# Altium project Telemetry_Pi_Board.PrjPcb
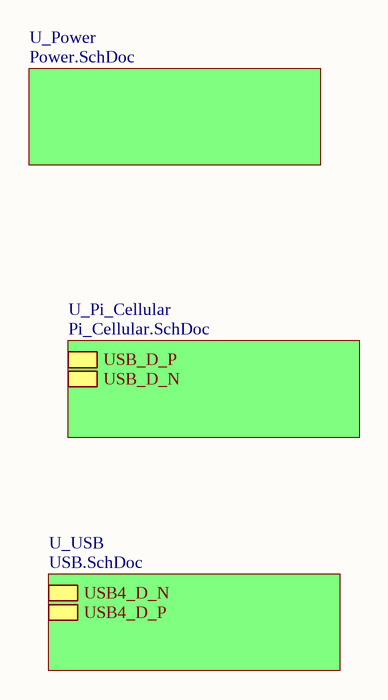
[diagram p0: Telemetry_Pi_Board.SchDoc]
6 sheets, 37 parts. Net scope: hierarchical (ports join the sheet entries above them; power ports are global).
Board file: PCB2.PcbDoc
Sheets:
  Telemetry_Pi_Board.SchDoc
    U_Power = Power.SchDoc
    U_Pi_Cellular = Pi_Cellular.SchDoc
    U_USB = USB.SchDoc
  Pi_Power.SchDoc
  Ethernet.SchDoc

## Sheet Telemetry_Pi_Board.SchDoc
size 279 x 215 mm; SheetNumber: 1; SheetTotal: 6

### Sub-sheets
U_Pi_Cellular = Pi_Cellular.SchDoc: USB_D_P, USB_D_N
U_Power = Power.SchDoc: no entries
U_USB = USB.SchDoc: USB4_D_N, USB4_D_P

## Sheet Power.SchDoc
size 279 x 215 mm; SheetNumber: 2; SheetTotal: 3
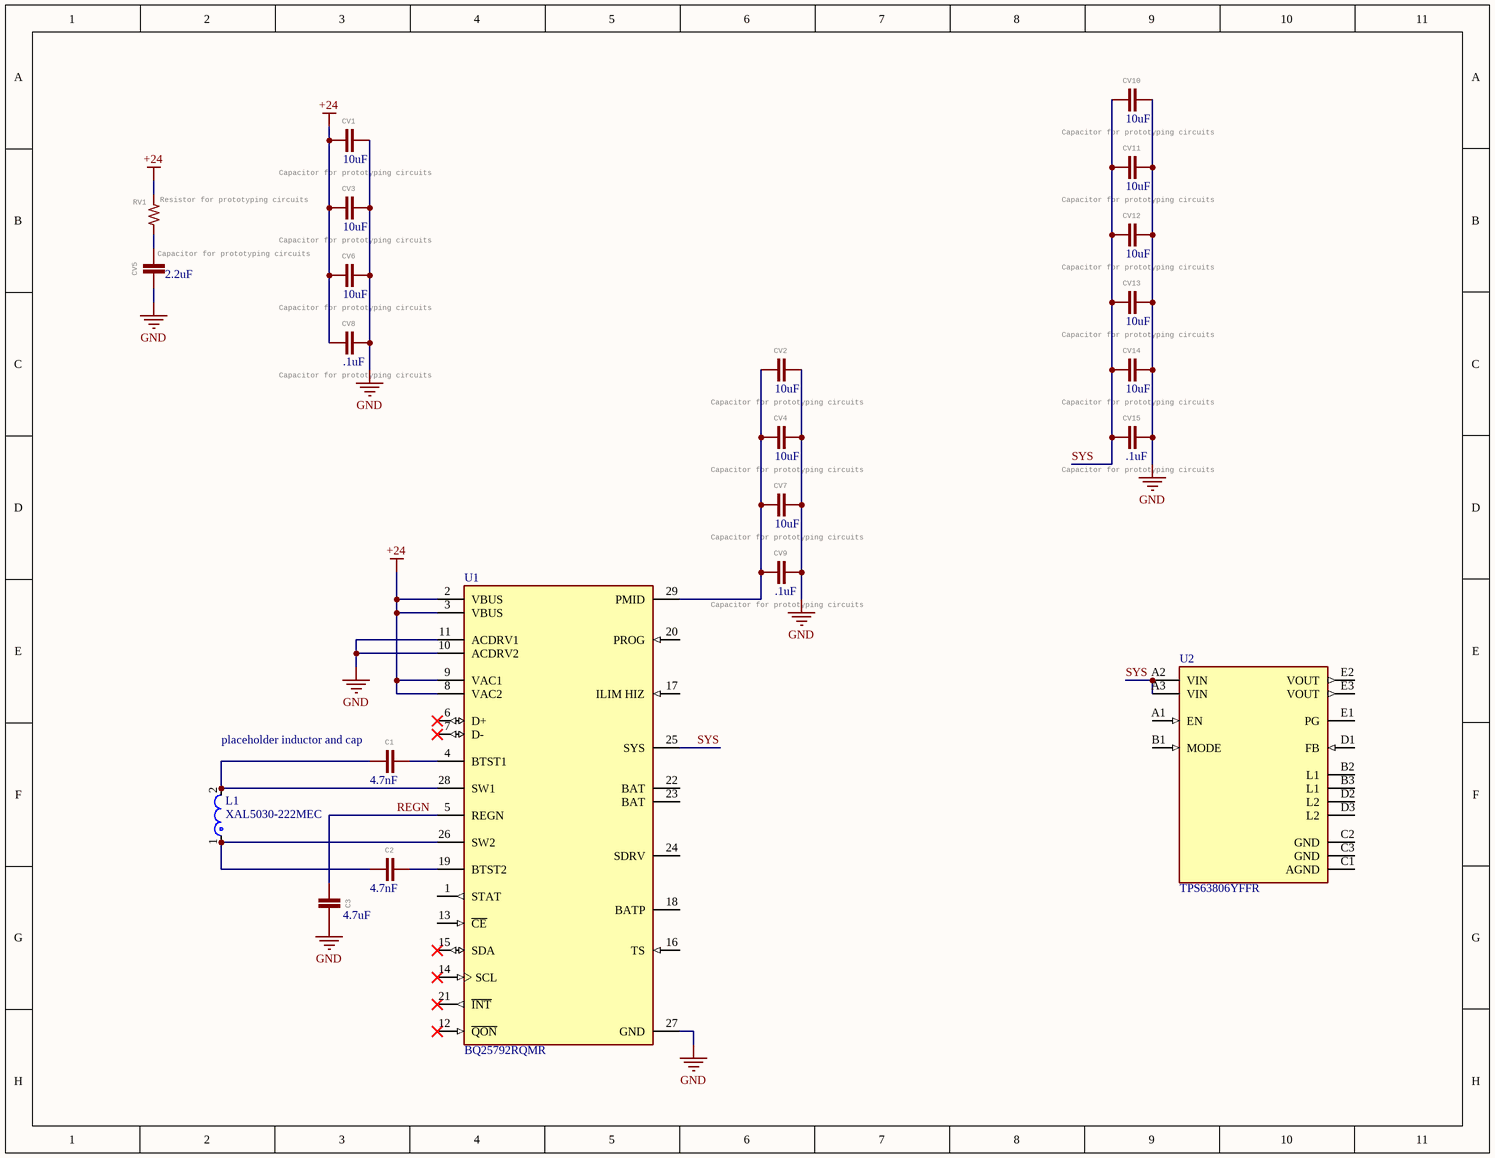
[diagram p1: Power.SchDoc]

### Parts
C1  CAPACITANCE: 4.7nF  [0805-CAP]  (hidden comment: Capacitor, Non-Polarized  VJ...1BC Series Datasheet  Samsung Datasheet  Walsin Datasheet  GRM188R61A226ME15D  GRM188R61E106MA73D  885012006013  2220Y6300105KXTWS2  Yageo Class 2, X5R  TDK C Series  AVX Automotive MLCC   KEMET X7R Series  Kyocera AVX  GRM21BR61H  C1812W104KDRACTU)
C2  CAPACITANCE: 4.7nF  [0805-CAP]  (hidden comment: Capacitor, Non-Polarized  VJ...1BC Series Datasheet  Samsung Datasheet  Walsin Datasheet  GRM188R61A226ME15D  GRM188R61E106MA73D  885012006013  2220Y6300105KXTWS2  Yageo Class 2, X5R  TDK C Series  AVX Automotive MLCC   KEMET X7R Series  Kyocera AVX  GRM21BR61H  C1812W104KDRACTU)
C3  CAPACITANCE: 4.7uF  [0805-CAP]  (hidden comment: Capacitor, Non-Polarized  VJ...1BC Series Datasheet  Samsung Datasheet  Walsin Datasheet  GRM188R61A226ME15D  GRM188R61E106MA73D  885012006013  2220Y6300105KXTWS2  Yageo Class 2, X5R  TDK C Series  AVX Automotive MLCC   KEMET X7R Series  Kyocera AVX  GRM21BR61H  C1812W104KDRACTU)
CV1  Capacitor for prototyping circuits  CAPACITANCE: 10uF  [0603-CAP]
CV2  Capacitor for prototyping circuits  CAPACITANCE: 10uF  [0603-CAP]
CV3  Capacitor for prototyping circuits  CAPACITANCE: 10uF  [0603-CAP]
CV4  Capacitor for prototyping circuits  CAPACITANCE: 10uF  [0603-CAP]
CV5  Capacitor for prototyping circuits  CAPACITANCE: 2.2uF  [0603-CAP]
CV6  Capacitor for prototyping circuits  CAPACITANCE: 10uF  [0603-CAP]
CV7  Capacitor for prototyping circuits  CAPACITANCE: 10uF  [0603-CAP]
CV8  Capacitor for prototyping circuits  CAPACITANCE: .1uF  [0603-CAP]
CV9  Capacitor for prototyping circuits  CAPACITANCE: .1uF  [0603-CAP]
CV10  Capacitor for prototyping circuits  CAPACITANCE: 10uF  [0603-CAP]
CV11  Capacitor for prototyping circuits  CAPACITANCE: 10uF  [0603-CAP]
CV12  Capacitor for prototyping circuits  CAPACITANCE: 10uF  [0603-CAP]
CV13  Capacitor for prototyping circuits  CAPACITANCE: 10uF  [0603-CAP]
CV14  Capacitor for prototyping circuits  CAPACITANCE: 10uF  [0603-CAP]
CV15  Capacitor for prototyping circuits  CAPACITANCE: .1uF  [0603-CAP]
L1  XAL5030-222MEC  [FP-XAL5030-222MEC-MFG]
RV1  Resistor for prototyping circuits  [0603-RES]
U1  BQ25792RQMR  [FP-RQM0029A-MFG]
U2  TPS63806YFFR  [FP-YFF0015-IPC_C]

### Nets
+24: CV1.2 CV3.2 CV6.2 CV8.2 RV1.2 U1.2(VBUS) U1.3(VBUS) U1.8(VAC2) U1.9(VAC1)
GND: C3.1 CV1.1 CV2.1 CV3.1 CV4.1 CV5.2 CV6.1 CV7.1 CV8.1 CV9.1 CV10.1 CV11.1 CV12.1 CV13.1 CV14.1 CV15.1 U1.10(ACDRV2) U1.11(ACDRV1) U1.27(GND)
REGN: C3.2 U1.5(REGN)
SYS: CV10.2 CV11.2 CV12.2 CV13.2 CV14.2 CV15.2 U1.25(SYS) U2.A2(VIN) U2.A3(VIN)
NetC1_1: C1.1 U1.4(BTST1)
NetC1_2: C1.2 L1.2 U1.28(SW1)
NetC2_1: C2.1 U1.19(BTST2)
NetC2_2: C2.2 L1.1 U1.26(SW2)
NetCV2_2: CV2.2 CV4.2 CV7.2 CV9.2 U1.29(PMID)
NetCV5_1: CV5.1 RV1.1

Not connected (* = marked no-connect by the designer): U1 1(STAT) 6(D+)* 7(D-)* 12(~{QON})* 13(~{CE}) 14(SCL)* 15(SDA)* 16(TS) 17(ILIM_HIZ) 18(BATP) 20(PROG) 21(~{INT})* 22(BAT) 23(BAT) 24(SDRV); U2 A1(EN) B1(MODE) B2(L1) B3(L1) C1(AGND) C2(GND) C3(GND) D1(FB) D2(L2) D3(L2) E1(PG) E2(VOUT) E3(VOUT)

### Notes on the sheet
- (near C1) placeholder inductor and cap

### Library data of the parts
C1-C3 = CAPACITOR_?_*0805: MPN: C0805C224K1RACTU; MPN: CC0805MKX5R8BB226; MANUFACTURER: Murata; MPN: GRM21BR61H106KE43L; GateName_1: G$1; DeviceName: 0805; CAPACITANCE: 0.22µF; DKPN: 399-8049-1-ND; MOPN: 80-C0805C224K1R; TOLERANCE: 10%; VOLTAGE: 100V; DKPN: 311-1903-1-ND; MOPN: 603-CC805MKX5R8BB226; TOLERANCE: 20%; VOLTAGE: 25V; CAPACITANCE: 10uF; DKPN: 490-18663-2-ND; MOPN: 81-GRM21BR61H106KE3L; VOLTAGE: 50V; SymbolName_1: CAPACITOR; LibraryName: HyTechDevices; DeviceSetName: CAPACITOR_?_*; Package: 0805-CAP; MANUFACTURER: KEMET; MANUFACTURER: Yageo
CV1-CV15 = CAPACITOR_VALUE: GateName_1: G$1; SymbolName_1: CAPACITOR_VALUE; LibraryName: HyTechDevices; DeviceSetName: CAPACITOR_VALUE; Package: 0603-CAP
L1 = CMP-11268-000158-1: Fixed Inductors 2.2uH Shld 20% 9.2A 14.5mOhms AECQ2 SRF: 38MHz Test Freq: 1MHz; Test Frequency: 100kHz; Core Material: Composite; Shielding: Shielded; DC Resistance (DCR): 14.5mR; RMS Current (Irms): 9.7A; Max Operating Temperature: 125°C; Self Resonant Frequency: 38MHz; Package Quantity: 400; Min Operating Temperature: -40°C; Width: 5.48mm; Series: XAL5030; Inductance: 2.2uH; Length: 5.68mm; RoHS Compliant: Yes; Termination: SMD/SMT; Packaging: Tape and Reel; Max DC Current: 9.2A; Saturation Current: 9.2A; Lead Free: Contains Lead; Mount: Surface Mount; Case/Package: SMD/SMT; Height: 3.1mm; Inductance Tolerance: 20%; Tolerance: 20%
RV1 = RESISTOR_VALUE: GateName_1: G$1; SymbolName_1: RESISTOR_VALUE; LibraryName: HyTechDevices; DeviceSetName: RESISTOR_VALUE; Package: 0603-RES
U1 = BQ25792RQMR: Power Supply Management Circuit, Adjustable, 1 Channel, 3.4, PQCC29; Manufacturer: Texas Instruments; RoHS Compliant: Yes; Supplier: Mouser; Supplier Part Number: 595-BQ25792RQMR; RoHS: Yes; Category: Battery Management; Stock: 1625; Pricing: 1=6.18, 10=5.59, 25=5.33, 50=5.33, 100=4.62, 250=4.42, 500=4.03, 1000=3.51, 3000=3.32, 6000=3.31, 10000=3.32 (USD); Manufacturer Part Number: BQ25792RQMR
U2 = TPS63806YFFR: Switching Regulator, Current-mode, 2.5A, 3100kHz Switching Freq-Max, PBGA15; Manufacturer: Texas Instruments; Supplier: Mouser; Supplier Part Number: 595-TPS63806YFFR; Manufacturer Part Number: TPS63806YFFR; RoHS: Yes; Category: Voltage Regulators - Switching; Stock: 11286; Pricing: 1=2.47, 10=2.22, 25=2.1, 50=2.1, 100=1.8, 250=1.7, 500=1.5, 1000=1.33, 3000=1.25, 6000=1.22, 10000=1.22 (USD); ComponentLink1URL: https://www.ti.com:443/lit/ds/symlink/tps63805.pdf?src-supplier=IHS+Markit; ComponentLink1Description: https://www.ti.com:443/lit/ds/symlink/tps63805.pdf?src-supplier=IHS+Markit

## Sheet Pi_Cellular.SchDoc
size A; SheetNumber: 3; SheetTotal: 6
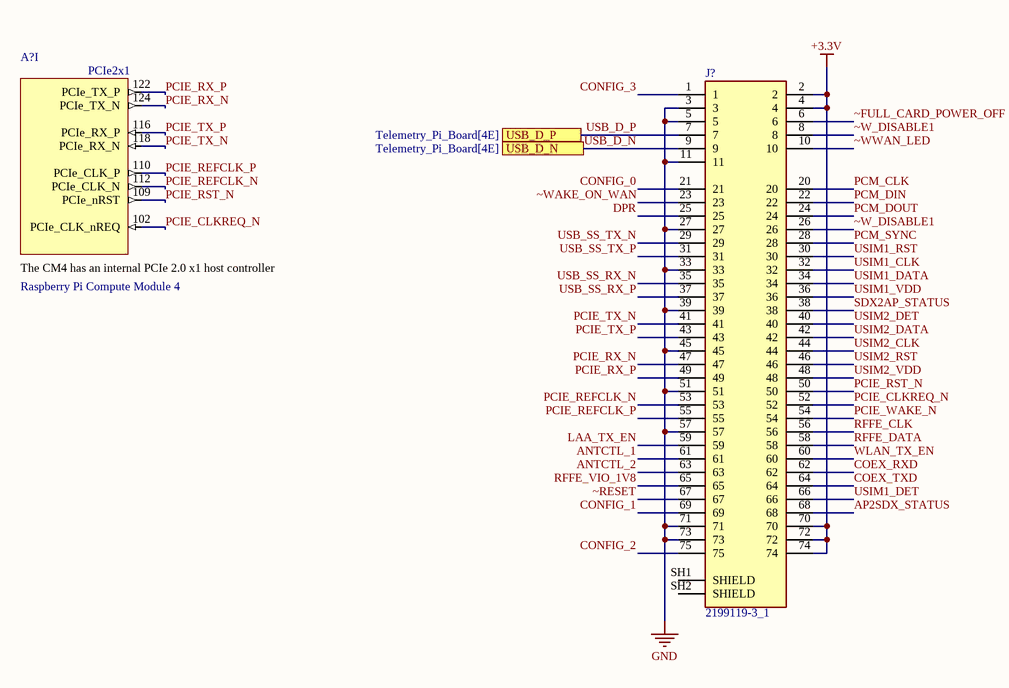
[diagram p2: Pi_Cellular.SchDoc]

### Parts
(Parts that share a designator on the sheet are numbered #1, #2 ... from top to bottom, then left to right.)
A?#1  Raspberry Pi Compute Module 4  [CM4-F40C-100DS-0.4v_1.5mm_0mm]  (part I of 21)  (no BOM)
J?  2199119-3_1  [TE_2199119-3]

### Ports
USB_D_N (see Telemetry_Pi_Board[4E]), USB_D_P (see Telemetry_Pi_Board[4E])

### Nets
+3.3V: J?.2 J?.4 J?.70 J?.72 J?.74
GND: J?.3 J?.5 J?.11 J?.27 J?.33 J?.39 J?.45 J?.51 J?.57 J?.71 J?.73
ANTCTL_1: J?.61
ANTCTL_2: J?.63
AP2SDX_STATUS: J?.68
COEX_RXD: J?.62
COEX_TXD: J?.64
CONFIG_0: J?.21
CONFIG_1: J?.69
CONFIG_2: J?.75
CONFIG_3: J?.1
DPR: J?.25
LAA_TX_EN: J?.59
PCIE_CLKREQ_N: A?#1.102(PCIe_CLK_nREQ) J?.52
PCIE_REFCLK_N: A?#1.112(PCIe_CLK_N) J?.53
PCIE_REFCLK_P: A?#1.110(PCIe_CLK_P) J?.55
PCIE_RST_N: A?#1.109(PCIe_nRST) J?.50
PCIE_RX_N: A?#1.124(PCIe_TX_N) J?.47
PCIE_RX_P: A?#1.122(PCIe_TX_P) J?.49
PCIE_TX_N: A?#1.118(PCIe_RX_N) J?.41
PCIE_TX_P: A?#1.116(PCIe_RX_P) J?.43
PCIE_WAKE_N: J?.54
PCM_CLK: J?.20
PCM_DIN: J?.22
PCM_DOUT: J?.24
PCM_SYNC: J?.28
RFFE_CLK: J?.56
RFFE_DATA: J?.58
RFFE_VIO_1V8: J?.65
SDX2AP_STATUS: J?.38
USB_D_N: J?.9 ; port USB_D_N
USB_D_P: J?.7 ; port USB_D_P
USB_SS_RX_N: J?.35
USB_SS_RX_P: J?.37
USB_SS_TX_N: J?.29
USB_SS_TX_P: J?.31
USIM1_CLK: J?.32
USIM1_DATA: J?.34
USIM1_DET: J?.66
USIM1_RST: J?.30
USIM1_VDD: J?.36
USIM2_CLK: J?.44
USIM2_DATA: J?.42
USIM2_DET: J?.40
USIM2_RST: J?.46
USIM2_VDD: J?.48
WLAN_TX_EN: J?.60
~FULL_CARD_POWER_OFF: J?.6
~RESET: J?.67
~W_DISABLE1: J?.8 J?.26
~WAKE_ON_WAN: J?.23
~WWAN_LED: J?.10

Not connected (* = marked no-connect by the designer): J? SH1(SHIELD) SH2(SHIELD)

### Notes on the sheet
- (in symbol CM4, part I) PCIe2x1; The CM4 has an internal PCIe 2.0 x1 host controller

### Library data of the parts
A?#1 = CM4: Raspberry Pi Compute Module 4 by Amornthep Phunsin
J? = 2199119-3_1: Connector, Backplane, Housing, Receptacle, 67 Position, 2row; MF: TE Connectivity; Check_prices: https://www.snapeda.com/parts/2199119-3/TE+Connectivity+AMP+Connectors/view-part/?ref=eda; Value: *; MP: 2199119-3; Purchase-URL: https://pricing.snapeda.com/search/part/2199119-3/?ref=eda; SnapEDA_Link: https://www.snapeda.com/parts/2199119-3/TE+Connectivity+AMP+Connectors/view-part/?ref=snap; Package: None; Digi-Key_Part_Number: A115899TR-ND; EU_RoHS_Compliance: Compliant

## Sheet USB.SchDoc
size A; SheetNumber: 4; SheetTotal: 6
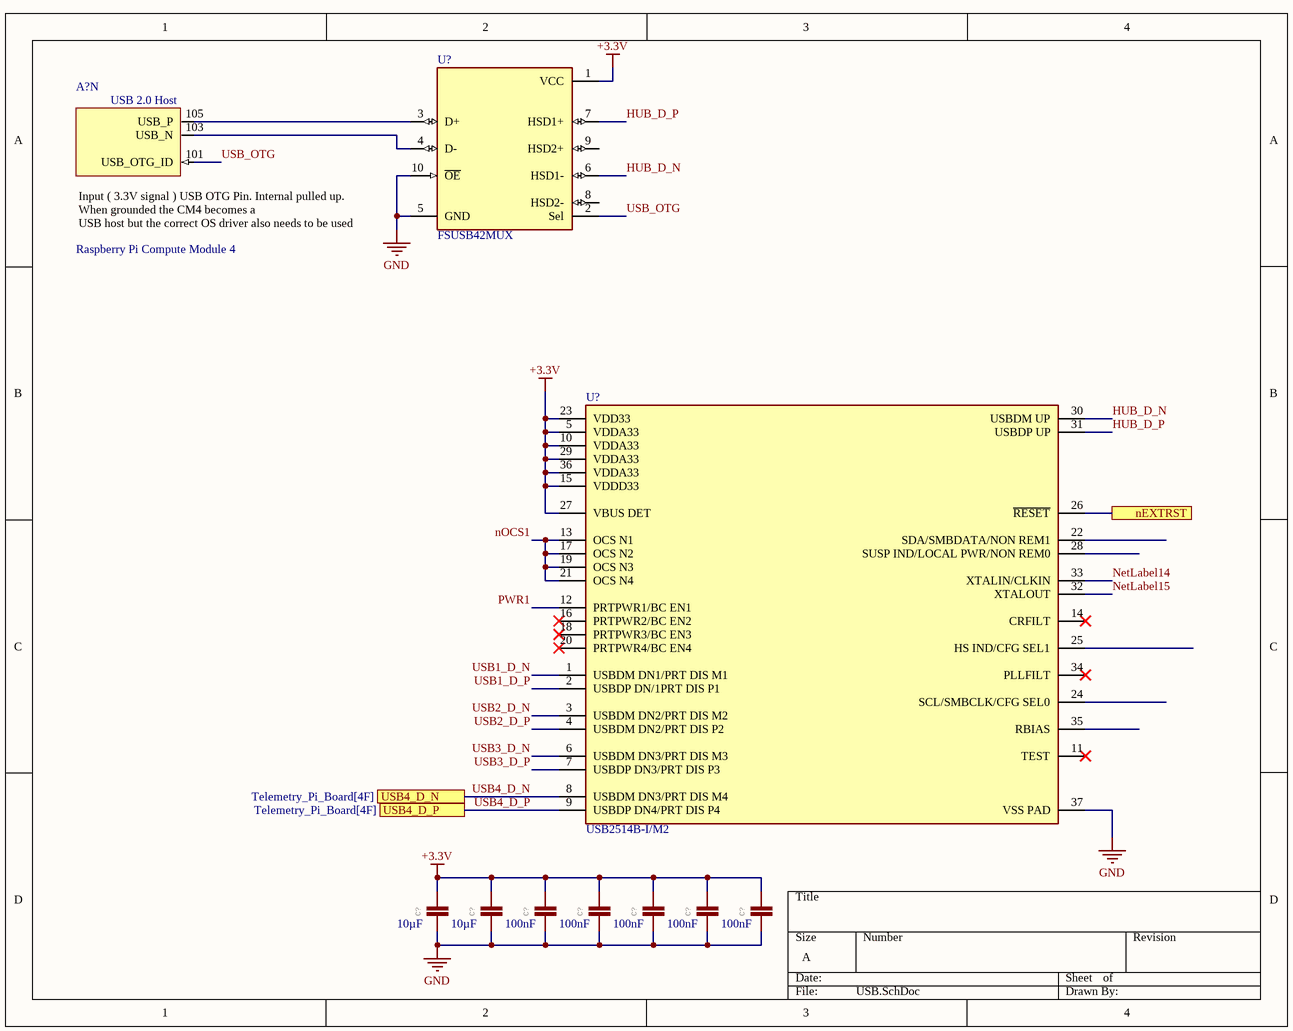
[diagram p3: USB.SchDoc]

### Parts
(Parts that share a designator on the sheet are numbered #1, #2 ... from top to bottom, then left to right.)
A?#2  Raspberry Pi Compute Module 4  [CM4-F40C-100DS-0.4v_1.5mm_0mm]  (part N of 21)  (no BOM)
C?#1  CAPACITANCE: 10µF  [0603-CAP]  (hidden comment: Capacitor, Non-Polarized  VJ...1BC Series Datasheet  Samsung Datasheet  Walsin Datasheet  GRM188R61A226ME15D  GRM188R61E106MA73D  885012006013  2220Y6300105KXTWS2  Yageo Class 2, X5R  TDK C Series  AVX Automotive MLCC   KEMET X7R Series  Kyocera AVX  GRM21BR61H  C1812W104KDRACTU)
C?#2  CAPACITANCE: 10µF  [0603-CAP]  (hidden comment: Capacitor, Non-Polarized  VJ...1BC Series Datasheet  Samsung Datasheet  Walsin Datasheet  GRM188R61A226ME15D  GRM188R61E106MA73D  885012006013  2220Y6300105KXTWS2  Yageo Class 2, X5R  TDK C Series  AVX Automotive MLCC   KEMET X7R Series  Kyocera AVX  GRM21BR61H  C1812W104KDRACTU)
C?#3  CAPACITANCE: 100nF  [0603-CAP]  (hidden comment: Capacitor, Non-Polarized  VJ...1BC Series Datasheet  Samsung Datasheet  Walsin Datasheet  GRM188R61A226ME15D  GRM188R61E106MA73D  885012006013  2220Y6300105KXTWS2  Yageo Class 2, X5R  TDK C Series  AVX Automotive MLCC   KEMET X7R Series  Kyocera AVX  GRM21BR61H  C1812W104KDRACTU)
C?#4  CAPACITANCE: 100nF  [0603-CAP]  (hidden comment: Capacitor, Non-Polarized  VJ...1BC Series Datasheet  Samsung Datasheet  Walsin Datasheet  GRM188R61A226ME15D  GRM188R61E106MA73D  885012006013  2220Y6300105KXTWS2  Yageo Class 2, X5R  TDK C Series  AVX Automotive MLCC   KEMET X7R Series  Kyocera AVX  GRM21BR61H  C1812W104KDRACTU)
C?#5  CAPACITANCE: 100nF  [0603-CAP]  (hidden comment: Capacitor, Non-Polarized  VJ...1BC Series Datasheet  Samsung Datasheet  Walsin Datasheet  GRM188R61A226ME15D  GRM188R61E106MA73D  885012006013  2220Y6300105KXTWS2  Yageo Class 2, X5R  TDK C Series  AVX Automotive MLCC   KEMET X7R Series  Kyocera AVX  GRM21BR61H  C1812W104KDRACTU)
C?#6  CAPACITANCE: 100nF  [0603-CAP]  (hidden comment: Capacitor, Non-Polarized  VJ...1BC Series Datasheet  Samsung Datasheet  Walsin Datasheet  GRM188R61A226ME15D  GRM188R61E106MA73D  885012006013  2220Y6300105KXTWS2  Yageo Class 2, X5R  TDK C Series  AVX Automotive MLCC   KEMET X7R Series  Kyocera AVX  GRM21BR61H  C1812W104KDRACTU)
C?#7  CAPACITANCE: 100nF  [0603-CAP]  (hidden comment: Capacitor, Non-Polarized  VJ...1BC Series Datasheet  Samsung Datasheet  Walsin Datasheet  GRM188R61A226ME15D  GRM188R61E106MA73D  885012006013  2220Y6300105KXTWS2  Yageo Class 2, X5R  TDK C Series  AVX Automotive MLCC   KEMET X7R Series  Kyocera AVX  GRM21BR61H  C1812W104KDRACTU)
U?#1  FSUSB42MUX  [FP-846AP-MFG]
U?#2  USB2514B-I/M2  [FP-36SQFN-3706-6x6B-IPC_B]

### Ports
nEXTRST, USB4_D_N (see Telemetry_Pi_Board[4F]), USB4_D_P (see Telemetry_Pi_Board[4F])

### Nets
+3.3V: C?#1.1 C?#2.1 C?#3.1 C?#4.1 C?#5.1 C?#6.1 C?#7.1 U?#1.1(VCC) U?#2.5(VDDA33) U?#2.10(VDDA33) U?#2.15(VDDD33) U?#2.23(VDD33) U?#2.27(VBUS_DET) U?#2.29(VDDA33) U?#2.36(VDDA33)
GND: C?#1.2 C?#2.2 C?#3.2 C?#4.2 C?#5.2 C?#6.2 C?#7.2 U?#1.5(GND) U?#1.10(~{OE}) U?#2.37(VSS_PAD)
HUB_D_N: U?#1.6(HSD1-) U?#2.30(USBDM_UP)
HUB_D_P: U?#1.7(HSD1+) U?#2.31(USBDP_UP)
NetLabel14: U?#2.33(XTALIN/CLKIN)
NetLabel15: U?#2.32(XTALOUT)
nOCS1: U?#2.13(OCS_N1) U?#2.17(OCS_N2) U?#2.19(OCS_N3) U?#2.21(OCS_N4)
PWR1: U?#2.12(PRTPWR1/BC_EN1)
USB1_D_N: U?#2.1(USBDM_DN1/PRT_DIS_M1)
USB1_D_P: U?#2.2(USBDP_DN/1PRT_DIS_P1)
USB2_D_N: U?#2.3(USBDM_DN2/PRT_DIS_M2)
USB2_D_P: U?#2.4(USBDM_DN2/PRT_DIS_P2)
USB3_D_N: U?#2.6(USBDM_DN3/PRT_DIS_M3)
USB3_D_P: U?#2.7(USBDP_DN3/PRT_DIS_P3)
USB4_D_N: U?#2.8(USBDM_DN3/PRT_DIS_M4) ; port USB4_D_N
USB4_D_P: U?#2.9(USBDP_DN4/PRT_DIS_P4) ; port USB4_D_P
USB_OTG: A?#2.101(USB_OTG_ID) U?#1.2(Sel)
NetA?#2_103: A?#2.103(USB_N) U?#1.4(D-)
NetA?#2_105: A?#2.105(USB_P) U?#1.3(D+)
NetU?#2_26: U?#2.26(~{RESET}) ; port nEXTRST

Not connected (* = marked no-connect by the designer): U?#1 8(HSD2-) 9(HSD2+); U?#2 11(TEST)* 14(CRFILT)* 16(PRTPWR2/BC_EN2)* 18(PRTPWR3/BC_EN3)* 20(PRTPWR4/BC_EN4)* 22(SDA/SMBDATA/NON_REM1) 24(SCL/SMBCLK/CFG_SEL0) 25(HS_IND/CFG_SEL1) 28(SUSP_IND/LOCAL_PWR/NON_REM0) 34(PLLFILT)* 35(RBIAS)

### Notes on the sheet
- (in symbol CM4, part N) USB 2.0 Host; Input ( 3.3V signal ) USB OTG Pin. Internal pulled up. When grounded the CM4 becomes a / USB host but the correct OS driver also needs to be used

### Library data of the parts
A?#2 = CM4: as A?#1 on sheet Pi_Cellular
C?#1 C?#2 = CAPACITOR_?_*0603: MPN: CC0603KRX7R0BB104; MPN: CC0603KRX7R0BB103; MPN: C0603C823K8RACTU; MANUFACTURER: Vishay Vitramon; MPN: VJ0603Y104JXQPW1BC; MPN: VJ0603Y224JXQCW1BC; MPN: CC0603KRX7R6BB103; MPN: VJ0603A150FXQPW1BC; MPN: CC0603KRX7R6BB105; MANUFACTURER: Murata Electronics; MANUFACTURER: Würth Elektronik; MPN: 885012006016; MPN: 885012206012; MANUFACTURER: Samsung Electro-Mechanics; MPN: CL10A475KP8NNNC; MPN: C0603C683K8RACTU; MPN: 0201ZA820JAT2A; MPN: CL10B104KA8NNNC; MANUFACTURER: Walsin Technology Corporation; MPN: 0603B224K250CT; MPN: CC0603KRX7R8BB122; MPN: CL10B105KA8NNNC; MANUFACTURER: TDK Corporation; MPN: C1608X5R1E475K080AC; MPN: 06033C473K4Z2A; MANUFACTURER: Taiyo Yuden; MPN: GMK107B7104KAHT; MPN: C1608X7R1V224K080AB; MPN: C1608X7R1V105K080AE; MPN: CC0603KRX7R9BB104; MPN: C1608C0G1H103J080AA; MPN: UMK107BJ105KA-T; MPN: CL10B471JB8NNNC; GateName_1: G$1; DeviceName: 0603; DKPN: 311-1523-1-ND; MOPN: 603-CC603KRX7R0BB104; TOLERANCE: 10%; VOLTAGE: 100V; CAPACITANCE: 10nF; DKPN: 311-1788-1-ND; MOPN: 603-CC603KRX7R0BB103; CAPACITANCE: 0.082µF; DKPN: 399-17417-2-ND; MOPN: 80-C0603C823K8R; VOLTAGE: 10V; CAPACITANCE: 0.1µF; DKPN: 720-1688-1-ND; MOPN: 77-VJ0603Y104JXQPBC; TOLERANCE: 5%; CAPACITANCE: 0.22µF; DKPN: 720-VJ0603Y224JXQCW1BCTR-ND; MOPN: 77-VJ0603Y224JXQCBC; DKPN: 311-4054-1-ND; MOPN: 603-CC603KRX7R6BB103; CAPACITANCE: 15pF; DKPN: 720-VJ0603A150FXQPW1BCCT-ND; MOPN: 77-VJ0603A150FXQPBC; TOLERANCE: 1%; CAPACITANCE: 1µF; DKPN: 311-1796-1-ND; MOPN: 603-CC603KRX7R6BB105; CAPACITANCE: 22µF; DKPN: 490-10476-1-ND; MOPN: 81-GRM188R61A226ME5D; TOLERANCE: 20%; CAPACITANCE: 3.3nF; DKPN: 732-7759-1-ND; MOPN: 710-885012006016; CAPACITANCE: 4.7nF; DKPN: 732-7931-1-ND; MOPN: 710-885012206012; CAPACITANCE: 4.7µF; DKPN: 1276-1044-1-ND; MOPN: 187-CL10A475KP8NNNC; CAPACITANCE: 680pF; DKPN: 732-7757-1-ND; MOPN: 710-885012006013; CAPACITANCE: 68nF; DKPN: 399-C0603C683K8RAC7867CT-ND; MOPN: 80-C0603C683K8R; CAPACITANCE: 82pF; DKPN: 478-1025-1-ND; MOPN: 581-0201ZA820JAT2A; DKPN: 1276-1006-1-ND; MOPN: 187-CL10B104KA8NNNC; VOLTAGE: 25V; DKPN: 1292-1420-1-ND; MOPN: 791-0603B224K250CT; CAPACITANCE: 1.2nF; DKPN: 311-4079-2-ND; MOPN: 603-CC603KRX7R8BB122; DKPN: 490-7202-1-ND; MOPN: 81-GRM188R61E106MA3D; DKPN: 1276-1184-1-ND; MOPN: 187-CL10B105KA8NNNC; CAPACITANCE: 4.7uF; DKPN: 445-9050-1-ND; MOPN: 810-C1608X5R1E475K; CAPACITANCE: 47nF; DKPN: 478-6340-1-ND; MOPN: 581-06033C473K42ZA; DKPN: 587-3354-1-ND; MOPN: 963-GMK107B7104KAHT; VOLTAGE: 35V; DKPN: 445-14239-1-ND; MOPN: 810-C1608X7R1V224K0B; DKPN: 445-173625-1-ND; MOPN: 810-C1608X7R1V105KAE; DKPN: 311-1344-1-ND; MOPN: 603-CC603KRX7R9BB104; VOLTAGE: 50V; DKPN: 445-7404-1-ND; MOPN: 810-C1608C0G1H103J; CAPACITANCE: 1uF; DKPN: 587-2400-2-ND; MOPN: 963-UMK107BJ105KA-T; CAPACITANCE: 470pF; DKPN: 1276-2058-1-ND; MOPN: 187-CL10B471JB8NNNC; CAPACITANCE: 47pF; DKPN: 445-12417-1-ND; MOPN: CGA3E2NP01H470J080AA; SymbolName_1: CAPACITOR; LibraryName: HyTechDevices; DeviceSetName: CAPACITOR_?_*; Package: 0603-CAP; MANUFACTURER: Yageo; MANUFACTURER: KEMET; MPN: GRM188R61A226ME15D; MPN: 885012006013; MANUFACTURER: Kyocera AVX; MANUFACTURER: YAGEO; MPN: GRM188R61E106MA73D; MPN: CGA3E2NP01H470J080AA
C?#3-C?#7 = CAPACITOR_?_*0603: MPN: CC0603KRX7R0BB104; MPN: CC0603KRX7R0BB103; MPN: C0603C823K8RACTU; MANUFACTURER: Vishay Vitramon; MPN: VJ0603Y104JXQPW1BC; MPN: VJ0603Y224JXQCW1BC; MPN: CC0603KRX7R6BB103; MPN: VJ0603A150FXQPW1BC; MPN: CC0603KRX7R6BB105; MANUFACTURER: Murata Electronics; MANUFACTURER: Würth Elektronik; MPN: 885012006016; MPN: 885012206012; MANUFACTURER: Samsung Electro-Mechanics; MPN: CL10A475KP8NNNC; MPN: C0603C683K8RACTU; MPN: 0201ZA820JAT2A; MPN: CL10B104KA8NNNC; MANUFACTURER: Walsin Technology Corporation; MPN: 0603B224K250CT; MPN: CC0603KRX7R8BB122; MPN: CL10B105KA8NNNC; MANUFACTURER: TDK Corporation; MPN: C1608X5R1E475K080AC; MPN: 06033C473K4Z2A; MANUFACTURER: Taiyo Yuden; MPN: GMK107B7104KAHT; MPN: C1608X7R1V224K080AB; MPN: C1608X7R1V105K080AE; MPN: CC0603KRX7R9BB104; MPN: C1608C0G1H103J080AA; MPN: UMK107BJ105KA-T; MPN: CL10B471JB8NNNC; GateName_1: G$1; DeviceName: 0603; DKPN: 311-1523-1-ND; MOPN: 603-CC603KRX7R0BB104; TOLERANCE: 10%; VOLTAGE: 100V; CAPACITANCE: 10nF; DKPN: 311-1788-1-ND; MOPN: 603-CC603KRX7R0BB103; CAPACITANCE: 0.082µF; DKPN: 399-17417-2-ND; MOPN: 80-C0603C823K8R; VOLTAGE: 10V; CAPACITANCE: 0.1µF; DKPN: 720-1688-1-ND; MOPN: 77-VJ0603Y104JXQPBC; TOLERANCE: 5%; CAPACITANCE: 0.22µF; DKPN: 720-VJ0603Y224JXQCW1BCTR-ND; MOPN: 77-VJ0603Y224JXQCBC; DKPN: 311-4054-1-ND; MOPN: 603-CC603KRX7R6BB103; CAPACITANCE: 15pF; DKPN: 720-VJ0603A150FXQPW1BCCT-ND; MOPN: 77-VJ0603A150FXQPBC; TOLERANCE: 1%; CAPACITANCE: 1µF; DKPN: 311-1796-1-ND; MOPN: 603-CC603KRX7R6BB105; CAPACITANCE: 22µF; DKPN: 490-10476-1-ND; MOPN: 81-GRM188R61A226ME5D; TOLERANCE: 20%; CAPACITANCE: 3.3nF; DKPN: 732-7759-1-ND; MOPN: 710-885012006016; CAPACITANCE: 4.7nF; DKPN: 732-7931-1-ND; MOPN: 710-885012206012; CAPACITANCE: 4.7µF; DKPN: 1276-1044-1-ND; MOPN: 187-CL10A475KP8NNNC; CAPACITANCE: 680pF; DKPN: 732-7757-1-ND; MOPN: 710-885012006013; CAPACITANCE: 68nF; DKPN: 399-C0603C683K8RAC7867CT-ND; MOPN: 80-C0603C683K8R; CAPACITANCE: 82pF; DKPN: 478-1025-1-ND; MOPN: 581-0201ZA820JAT2A; DKPN: 1276-1006-1-ND; MOPN: 187-CL10B104KA8NNNC; VOLTAGE: 25V; DKPN: 1292-1420-1-ND; MOPN: 791-0603B224K250CT; CAPACITANCE: 1.2nF; DKPN: 311-4079-2-ND; MOPN: 603-CC603KRX7R8BB122; CAPACITANCE: 10µF; DKPN: 490-7202-1-ND; MOPN: 81-GRM188R61E106MA3D; DKPN: 1276-1184-1-ND; MOPN: 187-CL10B105KA8NNNC; CAPACITANCE: 4.7uF; DKPN: 445-9050-1-ND; MOPN: 810-C1608X5R1E475K; CAPACITANCE: 47nF; DKPN: 478-6340-1-ND; MOPN: 581-06033C473K42ZA; DKPN: 587-3354-1-ND; MOPN: 963-GMK107B7104KAHT; VOLTAGE: 35V; DKPN: 445-14239-1-ND; MOPN: 810-C1608X7R1V224K0B; DKPN: 445-173625-1-ND; MOPN: 810-C1608X7R1V105KAE; DKPN: 311-1344-1-ND; MOPN: 603-CC603KRX7R9BB104; VOLTAGE: 50V; DKPN: 445-7404-1-ND; MOPN: 810-C1608C0G1H103J; CAPACITANCE: 1uF; DKPN: 587-2400-2-ND; MOPN: 963-UMK107BJ105KA-T; CAPACITANCE: 470pF; DKPN: 1276-2058-1-ND; MOPN: 187-CL10B471JB8NNNC; CAPACITANCE: 47pF; DKPN: 445-12417-1-ND; MOPN: CGA3E2NP01H470J080AA; SymbolName_1: CAPACITOR; LibraryName: HyTechDevices; DeviceSetName: CAPACITOR_?_*; Package: 0603-CAP; MANUFACTURER: Yageo; MANUFACTURER: KEMET; MPN: GRM188R61A226ME15D; MPN: 885012006013; MANUFACTURER: Kyocera AVX; MANUFACTURER: YAGEO; MPN: GRM188R61E106MA73D; MPN: CGA3E2NP01H470J080AA
U?#1 = CMP-07103-000004-1: IC USB SWITCH DPDT 10MSOP; Voltage: 4.3V; Current: 100mA; Number of Inputs: 2; Supply Type: Single; Number of Outputs: 4; Data Rate: 480Mbps; On-State Resistance: 6.5R; Min Supply Voltage: 3V; Package Quantity: 1; Length: 3mm; Radiation Hardening: No; Number of Pins: 10; Width: 3mm; Number of Channels: 2; REACH SVHC: No SVHC; Lead Free: Lead Free; Max Operating Temperature: 85°C; Min Operating Temperature: -40°C; Packaging: Tape and Reel; Throw Configuration: DPDT; Operating Supply Voltage: 4.3V; Max Supply Voltage: 4.3V; Mount: Surface Mount; Case/Package: MSOP; Weight: 0.1125g; Height: 0.85mm
U?#2 = CMP-06284-000036-1: IC HUB CTLR 4PORT USB 2.0 HS 36S; Min Supply Voltage: 3V; Number of Ports: 4; Operating Supply Current: 70mA; Data Rate: 480Mbps; USB Standard: USB 2.0; Max Supply Voltage: 3.6V; REACH SVHC: No SVHC; Packaging: Tray; Min Operating Temperature: -40°C; RoHS Compliant: Yes; Number of Pins: 36; Interface: USB; Max Operating Temperature: 85°C; Lead Free: Lead Free

## Sheet Pi_Power.SchDoc
size A; SheetNumber: 3; SheetTotal: 3
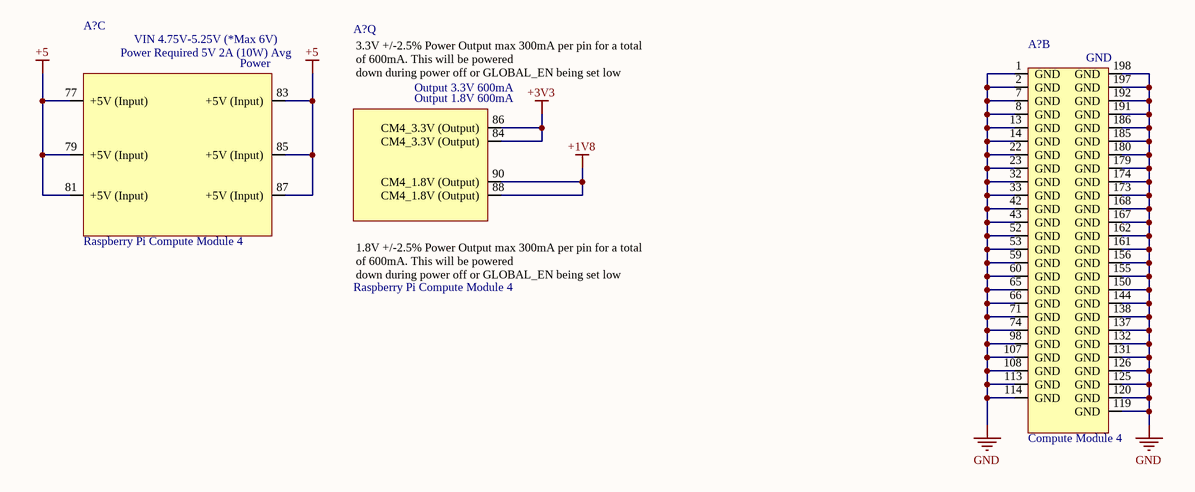
[diagram p4: Pi_Power.SchDoc]

### Parts
(Parts that share a designator on the sheet are numbered #1, #2 ... from top to bottom, then left to right.)
A?#3  Compute Module 4  [CM4-F40C-100DS-0.4v_1.5mm_0mm]  (part B of 21)  (no BOM)
A?#4  Raspberry Pi Compute Module 4  [CM4-F40C-100DS-0.4v_1.5mm_0mm]  (part C of 21)  (no BOM)
A?#5  Raspberry Pi Compute Module 4  [CM4-F40C-100DS-0.4v_1.5mm_0mm]  (part Q of 21)  (no BOM)

### Nets
+1V8: A?#5.88(CM4_1.8V_(Output)) A?#5.90(CM4_1.8V_(Output))
+3V3: A?#5.84(CM4_3.3V_(Output)) A?#5.86(CM4_3.3V_(Output))
+5: A?#4.77(+5V_(Input)) A?#4.79(+5V_(Input)) A?#4.81(+5V_(Input)) A?#4.83(+5V_(Input)) A?#4.85(+5V_(Input)) A?#4.87(+5V_(Input))
GND: A?#3.1(GND) A?#3.2(GND) A?#3.7(GND) A?#3.8(GND) A?#3.13(GND) A?#3.14(GND) A?#3.22(GND) A?#3.23(GND) A?#3.32(GND) A?#3.33(GND) A?#3.42(GND) A?#3.43(GND) A?#3.52(GND) A?#3.53(GND) A?#3.59(GND) A?#3.60(GND) A?#3.65(GND) A?#3.66(GND) A?#3.71(GND) A?#3.74(GND) A?#3.98(GND) A?#3.107(GND) A?#3.108(GND) A?#3.113(GND) A?#3.114(GND) A?#3.119(GND) A?#3.120(GND) A?#3.125(GND) A?#3.126(GND) A?#3.131(GND) A?#3.132(GND) A?#3.137(GND) A?#3.138(GND) A?#3.144(GND) A?#3.150(GND) A?#3.155(GND) A?#3.156(GND) A?#3.161(GND) A?#3.162(GND) A?#3.167(GND) A?#3.168(GND) A?#3.173(GND) A?#3.174(GND) A?#3.179(GND) A?#3.180(GND) A?#3.185(GND) A?#3.186(GND) A?#3.191(GND) A?#3.192(GND) A?#3.197(GND) A?#3.198(GND)

### Notes on the sheet
- (in symbol CM4, part C) VIN 4.75V-5.25V (*Max 6V); Power Required 5V 2A (10W) Avg; Power; by Amornthep Phunsin
- (in symbol CM4, part Q) 3.3V +/-2.5% Power Output max 300mA per pin for a total of 600mA. This will be powered / down during power off or GLOBAL_EN being set low; Output 3.3V 600mA; Output 1.8V 600mA; 1.8V +/-2.5% Power Output max 300mA per pin for a total of 600mA. This will be powered / down during power off or GLOBAL_EN being set low

### Library data of the parts
A?#3-A?#5 = CM4: as A?#1 on sheet Pi_Cellular

## Sheet Ethernet.SchDoc
size A; SheetNumber: 6; SheetTotal: 6

## Nets that join several sheets
+3.3V: Pi_Cellular (5 pins), USB (15 pins)
GND: Power (19 pins), Pi_Cellular (11 pins), USB (10 pins), Pi_Power (51 pins)